# Altium schematic sheet Sheet1.SchDoc
size C
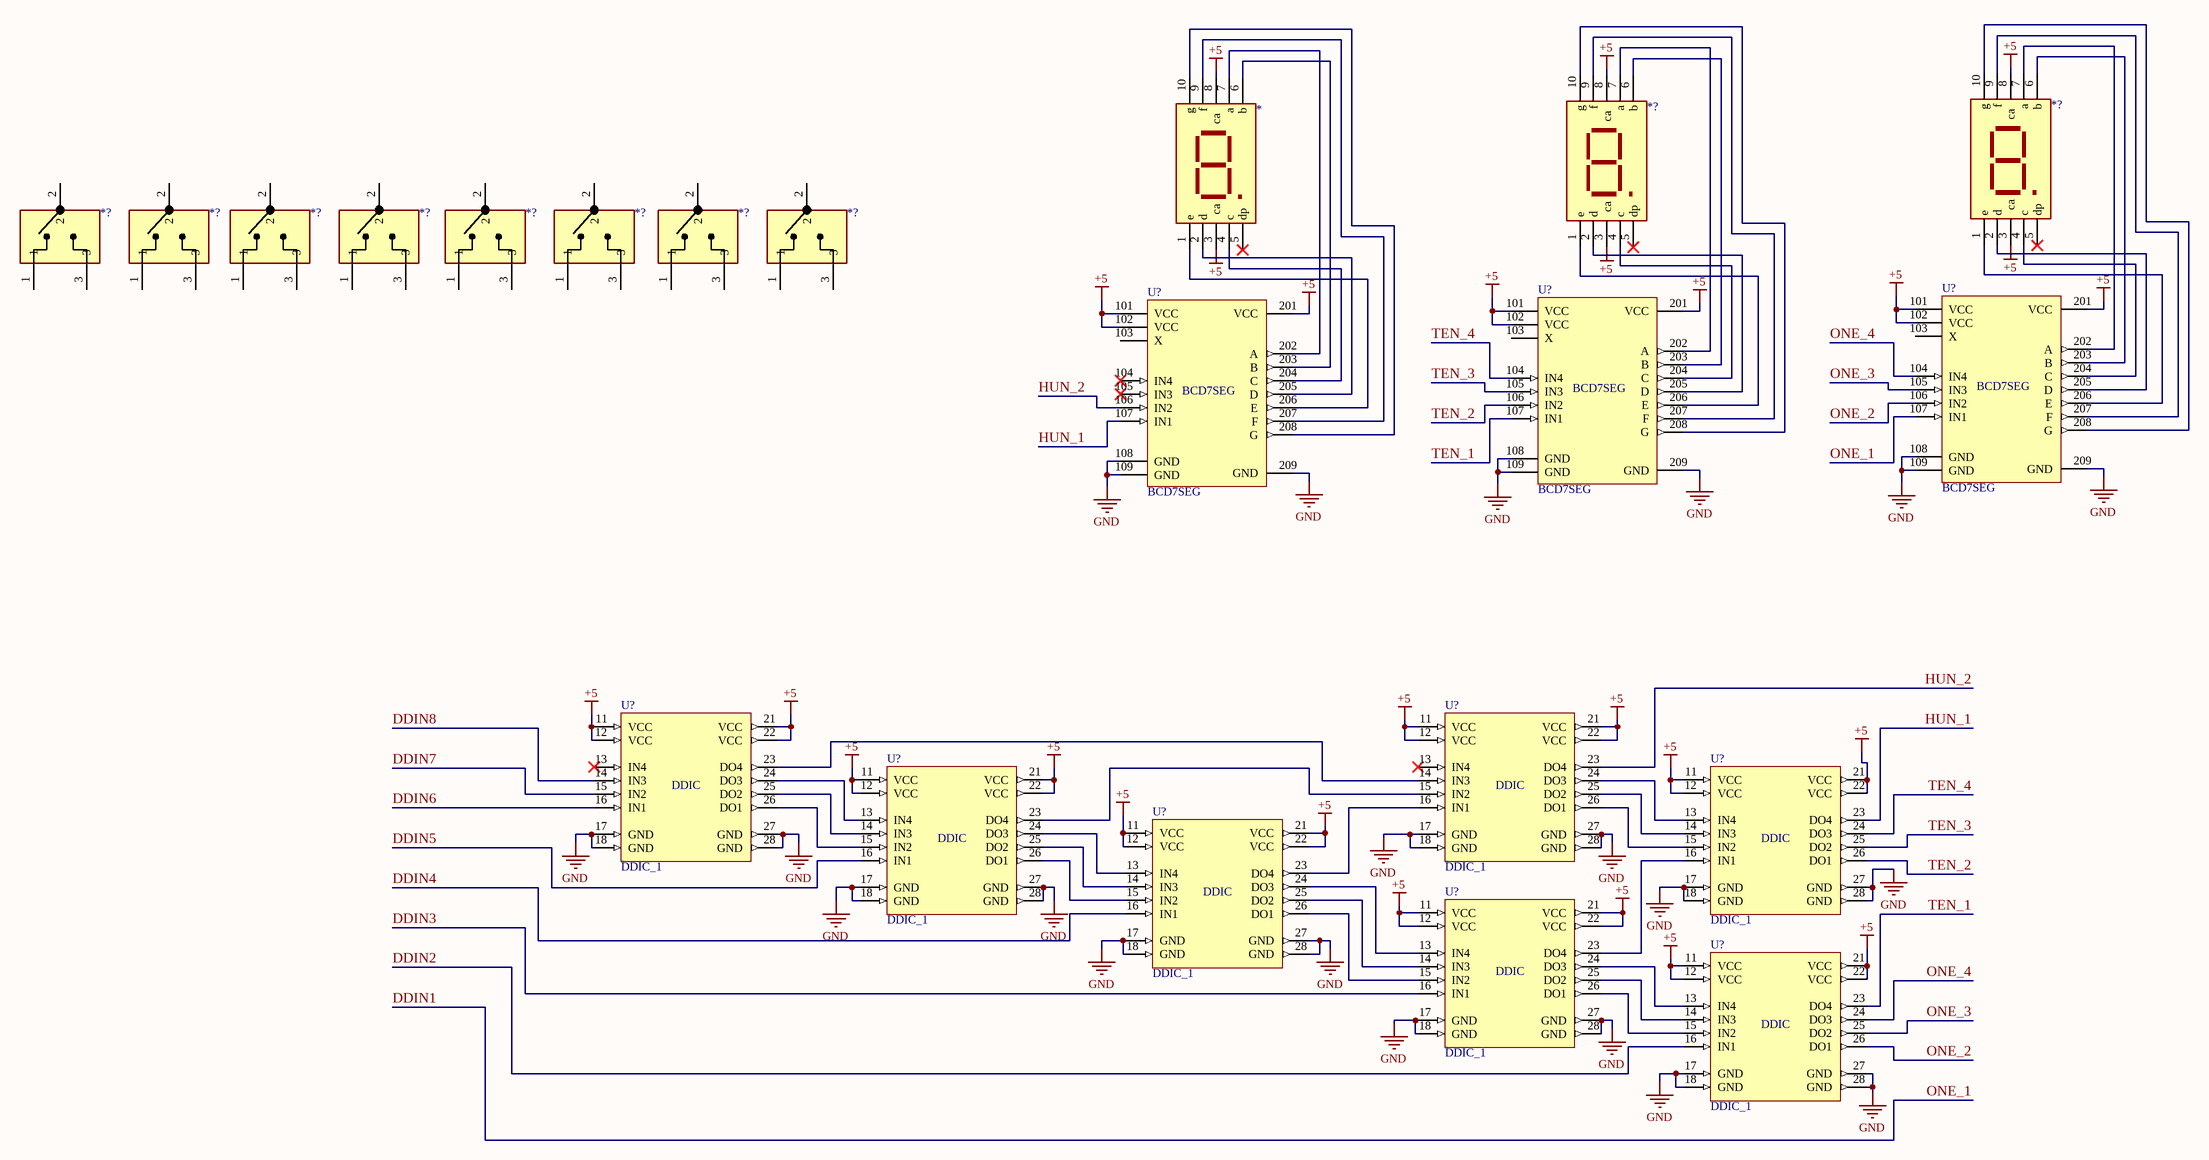
[diagram p0: Sheet1.SchDoc]

## Parts
(Parts that share a designator on the sheet are numbered #1, #2 ... from top to bottom, then left to right.)
*  7SEG_1DIGIT_CA_1INCH  [7SEG_1DIGIT_CA_1INCH]  (value not drawn)
*?#1  7SEG_1DIGIT_CA_1INCH  [7SEG_1DIGIT_CA_1INCH]  (value not drawn)
*?#2  7SEG_1DIGIT_CA_1INCH  [7SEG_1DIGIT_CA_1INCH]  (value not drawn)
*?#3  MTS_102_3P_125V_6A  [MTS_102_3P_125V_6A]  (value not drawn)
*?#4  MTS_102_3P_125V_6A  [MTS_102_3P_125V_6A]  (value not drawn)
*?#5  MTS_102_3P_125V_6A  [MTS_102_3P_125V_6A]  (value not drawn)
*?#6  MTS_102_3P_125V_6A  [MTS_102_3P_125V_6A]  (value not drawn)
*?#7  MTS_102_3P_125V_6A  [MTS_102_3P_125V_6A]  (value not drawn)
*?#8  MTS_102_3P_125V_6A  [MTS_102_3P_125V_6A]  (value not drawn)
*?#9  MTS_102_3P_125V_6A  [MTS_102_3P_125V_6A]  (value not drawn)
*?#10  MTS_102_3P_125V_6A  [MTS_102_3P_125V_6A]  (value not drawn)
U?#1  BCD7SEG  [BCD7SEG]
U?#2  BCD7SEG  [BCD7SEG]
U?#3  BCD7SEG  [BCD7SEG]
U?#4  DDIC_1  [DDIC]
U?#5  DDIC_1  [DDIC]
U?#6  DDIC_1  [DDIC]
U?#7  DDIC_1  [DDIC]
U?#8  DDIC_1  [DDIC]
U?#9  DDIC_1  [DDIC]
U?#10  DDIC_1  [DDIC]

## Nets
+5: *.3(ca) *.8(ca) *?#1.3(ca) *?#1.8(ca) *?#2.3(ca) *?#2.8(ca) U?#1.101(VCC) U?#1.102(VCC) U?#1.201(VCC) U?#2.101(VCC) U?#2.102(VCC) U?#2.201(VCC) U?#3.101(VCC) U?#3.102(VCC) U?#3.201(VCC) U?#4.11(VCC) U?#4.12(VCC) U?#4.21(VCC) U?#4.22(VCC) U?#5.11(VCC) U?#5.12(VCC) U?#5.21(VCC) U?#5.22(VCC) U?#6.11(VCC) U?#6.12(VCC) U?#6.21(VCC) U?#6.22(VCC) U?#7.11(VCC) U?#7.12(VCC) U?#7.21(VCC) U?#7.22(VCC) U?#8.11(VCC) U?#8.12(VCC) U?#8.21(VCC) U?#8.22(VCC) U?#9.11(VCC) U?#9.12(VCC) U?#9.21(VCC) U?#9.22(VCC) U?#10.11(VCC) U?#10.12(VCC) U?#10.21(VCC) U?#10.22(VCC)
GND: U?#1.108(GND) U?#1.109(GND) U?#1.209(GND) U?#2.108(GND) U?#2.109(GND) U?#2.209(GND) U?#3.108(GND) U?#3.109(GND) U?#3.209(GND) U?#4.17(GND) U?#4.18(GND) U?#4.27(GND) U?#4.28(GND) U?#5.17(GND) U?#5.18(GND) U?#5.27(GND) U?#5.28(GND) U?#6.17(GND) U?#6.18(GND) U?#6.27(GND) U?#6.28(GND) U?#7.17(GND) U?#7.18(GND) U?#7.27(GND) U?#7.28(GND) U?#8.17(GND) U?#8.18(GND) U?#8.27(GND) U?#8.28(GND) U?#9.17(GND) U?#9.18(GND) U?#9.27(GND) U?#9.28(GND) U?#10.17(GND) U?#10.18(GND) U?#10.27(GND) U?#10.28(GND)
DDIN1: U?#2.107(IN1)  [also labelled ONE_1]
DDIN2: U?#10.16(IN1)
DDIN3: U?#9.16(IN1)
DDIN4: U?#8.16(IN1)
DDIN5: U?#6.16(IN1)
DDIN6: U?#4.16(IN1)
DDIN7: U?#4.15(IN2)
DDIN8: U?#4.14(IN3)
HUN_1: U?#3.107(IN1) U?#7.23(DO4)
HUN_2: U?#3.106(IN2) U?#5.23(DO4)
ONE_2: U?#2.106(IN2) U?#10.26(DO1)
ONE_3: U?#2.105(IN3) U?#10.25(DO2)
ONE_4: U?#2.104(IN4) U?#10.24(DO3)
TEN_1: U?#1.107(IN1) U?#10.23(DO4)
TEN_2: U?#1.106(IN2) U?#7.26(DO1)
TEN_3: U?#1.105(IN3) U?#7.25(DO2)
TEN_4: U?#1.104(IN4) U?#7.24(DO3)
Net*?#1_1: *?#1.1(e) U?#1.206(E)
Net*?#1_2: *?#1.2(d) U?#1.205(D)
Net*?#1_4: *?#1.4(c) U?#1.204(C)
Net*?#1_6: *?#1.6(b) U?#1.203(B)
Net*?#1_7: *?#1.7(a) U?#1.202(A)
Net*?#1_9: *?#1.9(f) U?#1.207(F)
Net*?#1_10: *?#1.10(g) U?#1.208(G)
Net*?#2_1: *?#2.1(e) U?#2.206(E)
Net*?#2_2: *?#2.2(d) U?#2.205(D)
Net*?#2_4: *?#2.4(c) U?#2.204(C)
Net*?#2_6: *?#2.6(b) U?#2.203(B)
Net*?#2_7: *?#2.7(a) U?#2.202(A)
Net*?#2_9: *?#2.9(f) U?#2.207(F)
Net*?#2_10: *?#2.10(g) U?#2.208(G)
Net*_1: *.1(e) U?#3.206(E)
Net*_2: *.2(d) U?#3.205(D)
Net*_4: *.4(c) U?#3.204(C)
Net*_6: *.6(b) U?#3.203(B)
Net*_7: *.7(a) U?#3.202(A)
Net*_9: *.9(f) U?#3.207(F)
Net*_10: *.10(g) U?#3.208(G)
NetU?#4_23: U?#4.23(DO4) U?#5.14(IN3)
NetU?#4_24: U?#4.24(DO3) U?#6.13(IN4)
NetU?#4_25: U?#4.25(DO2) U?#6.14(IN3)
NetU?#4_26: U?#4.26(DO1) U?#6.15(IN2)
NetU?#5_15: U?#5.15(IN2) U?#6.23(DO4)
NetU?#5_16: U?#5.16(IN1) U?#8.23(DO4)
NetU?#5_24: U?#5.24(DO3) U?#7.13(IN4)
NetU?#5_25: U?#5.25(DO2) U?#7.14(IN3)
NetU?#5_26: U?#5.26(DO1) U?#7.15(IN2)
NetU?#6_24: U?#6.24(DO3) U?#8.13(IN4)
NetU?#6_25: U?#6.25(DO2) U?#8.14(IN3)
NetU?#6_26: U?#6.26(DO1) U?#8.15(IN2)
NetU?#7_16: U?#7.16(IN1) U?#9.23(DO4)
NetU?#8_24: U?#8.24(DO3) U?#9.13(IN4)
NetU?#8_25: U?#8.25(DO2) U?#9.14(IN3)
NetU?#8_26: U?#8.26(DO1) U?#9.15(IN2)
NetU?#9_24: U?#9.24(DO3) U?#10.13(IN4)
NetU?#9_25: U?#9.25(DO2) U?#10.14(IN3)
NetU?#9_26: U?#9.26(DO1) U?#10.15(IN2)

Not connected (* = marked no-connect by the designer): * 5(dp)*; *?#1 5(dp)*; *?#2 5(dp)*; *?#3 1 2 3; *?#4 1 2 3; *?#5 1 2 3; *?#6 1 2 3; *?#7 1 2 3; *?#8 1 2 3; *?#9 1 2 3; *?#10 1 2 3; U?#1 103(X); U?#2 103(X); U?#3 103(X) 104(IN4)* 105(IN3)*; U?#4 13(IN4)*; U?#5 13(IN4)*

## Notes on the sheet
- (in symbol DDIC_1) DDIC